# Altium schematic sheet Intan_RHS2116.SchDoc
size A4; DocumentNumber: 2; SheetNumber: 2; SheetTotal: 2
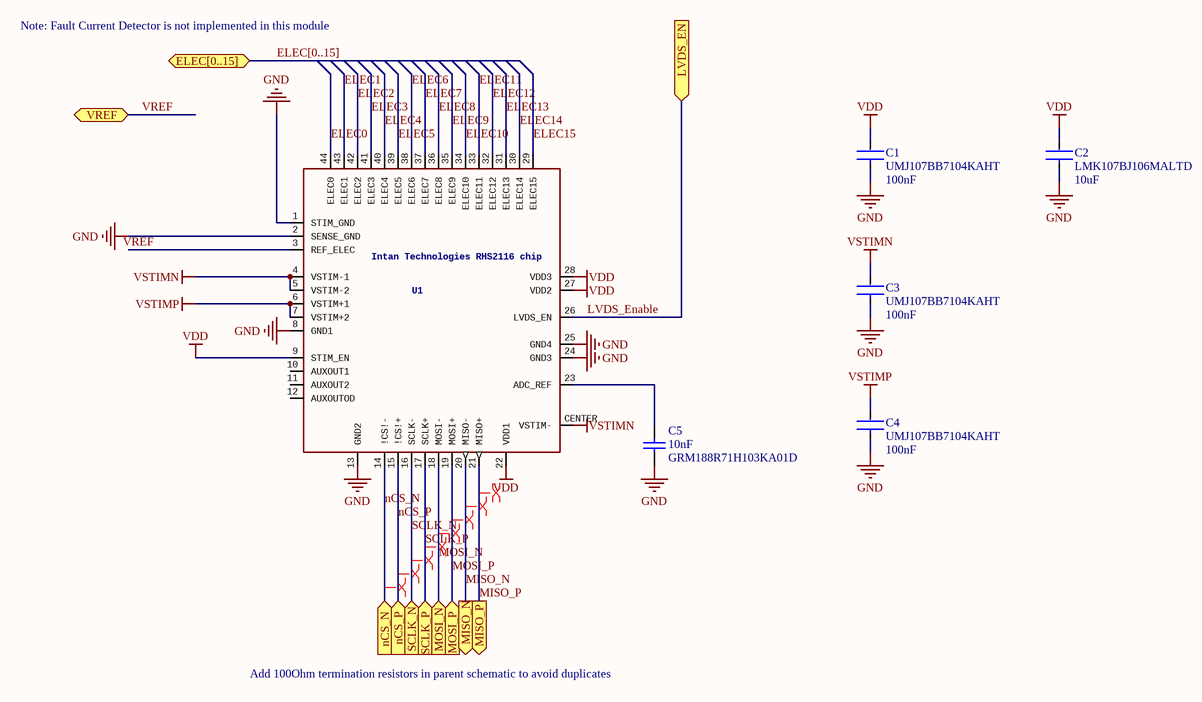
[diagram p0: Intan_RHS2116.SchDoc]

## Parts
C1  UMJ107BB7104KAHT  Capacitance: 100nF  [FP-0603-L_1_6_0_2-W_0_8_0-IPC_B]
C2  LMK107BJ106MALTD  Capacitance: 10uF  [FP-LMK107BJ106MALTD-IPC_B]
C3  UMJ107BB7104KAHT  Capacitance: 100nF  [FP-0603-L_1_6_0_2-W_0_8_0-IPC_B]
C4  UMJ107BB7104KAHT  Capacitance: 100nF  [FP-0603-L_1_6_0_2-W_0_8_0-IPC_B]
C5  GRM188R71H103KA01D  Capacitance: 10nF  [CAPC1608X90X35ML10T15]
U1  Intan Technologies RHS2116 chip  [QFN44_7_X_7]

## Ports
ELEC[0..15] (bidir), LVDS_EN (in), MISO_N (out), MISO_P (out), MOSI_N (in), MOSI_P (in), nCS_N (in), nCS_P (in), SCLK_N (in), SCLK_P (in), VREF (bidir)

## Nets
GND: C1.1 C2.1 C3.1 C4.1 C5.1 U1.1(STIM_GND) U1.2(SENSE_GND) U1.8(GND1) U1.13(GND2) U1.24(GND3) U1.25(GND4)
VDD: C1.2 C2.2 U1.9(STIM_EN) U1.22(VDD1) U1.27(VDD2) U1.28(VDD3)
VSTIMN: C3.2 U1.4(VSTIM-1) U1.5(VSTIM-2) U1.CENTER(VSTIM-)
VSTIMP: C4.2 U1.6(VSTIM+1) U1.7(VSTIM+2)
ELEC0: U1.44(ELEC0)
ELEC1: U1.43(ELEC1)
ELEC2: U1.42(ELEC2)
ELEC3: U1.41(ELEC3)
ELEC4: U1.40(ELEC4)
ELEC5: U1.39(ELEC5)
ELEC6: U1.38(ELEC6)
ELEC7: U1.37(ELEC7)
ELEC8: U1.36(ELEC8)
ELEC9: U1.35(ELEC9)
ELEC10: U1.34(ELEC10)
ELEC11: U1.33(ELEC11)
ELEC12: U1.32(ELEC12)
ELEC13: U1.31(ELEC13)
ELEC14: U1.30(ELEC14)
ELEC15: U1.29(ELEC15)
LVDS_Enable: U1.26(LVDS_EN) ; port LVDS_EN
MISO_N: U1.20(MISO-) ; port MISO_N
MISO_P: U1.21(MISO+) ; port MISO_P
MOSI_N: U1.18(MOSI-) ; port MOSI_N
MOSI_P: U1.19(MOSI+) ; port MOSI_P
nCS_N: U1.14(!CS!-) ; port nCS_N
nCS_P: U1.15(!CS!+) ; port nCS_P
SCLK_N: U1.16(SCLK-) ; port SCLK_N
SCLK_P: U1.17(SCLK+) ; port SCLK_P
VREF: U1.3(REF_ELEC) ; port VREF
NetC5_2: C5.2 U1.23(ADC_REF)

Not connected (* = marked no-connect by the designer): U1 10(AUXOUT1) 11(AUXOUT2) 12(AUXOUTOD)

## Buses and harness runs
bus ELEC[0..15] = port ELEC[0..15]

## Layout directives
differential pair: MISO_N, MISO_P, MOSI_N, MOSI_P, nCS_N, nCS_P, SCLK_N, SCLK_P

## Notes on the sheet
- Note: Fault Current Detector is not implemented in this module
- Add 100Ohm termination resistors in parent schematic to avoid duplicates

## Library data of the parts
C1 C3 C4 = CMP-14477-005276-2: Multilayer Ceramic Capacitor 0.1uF 50V X7R 10% SMD 0603 T/R; RoHS Compliant: Yes; Length: 0.063inch; Max Operating Temperature: 125°C; Case Code (Metric): 1608; Case/Package: 0603; Min Operating Temperature: -55°C; Tolerance: 10%; Mount: Surface Mount; Ratings: AEC-Q200; Features: Soft Termination; Thickness: 0.039inch; Width: 0.031inch; Packaging: Tape and Reel; Case Code (Imperial): 0603; Voltage Rating: 50V
C2 = CMP-2000-05443-2: CAP CER 10UF 10V X5R 0603; Tolerance: 20%; Series: M; Case Code (Metric): 1608; Height: 0.8mm; Resistor Type: Ceramic; Length: 1.6mm; REACH SVHC: No SVHC; Package Quantity: 4000; Lead Free: Lead Free; Voltage Rating (DC): 10V; Thickness: 0.035inch; Width: 0.031inch; Max Operating Temperature: 85°C; Number of Pins: 2; RoHS Compliant: Yes; Voltage Rating: 10V; Case/Package: 0603; Termination: SMD/SMT; Min Operating Temperature: -55°C; Dielectric: X5R; Construction: Flat; Packaging: Tape and Reel; Mount: Surface Mount; Case Code (Imperial): 0603
C5 = CMP-2100-03642-1: Chip Capacitor, 10 nF, +/- 10%, 50 V, -55 to 125 degC, 0603 (1608 Metric), RoHS, Tape and Reel; Manufacturer: Murata; Insulation Resistance: 10GR; Dielectric: X7R; Voltage Rating: 50V; Material: Ceramic; Package Quantity: 1; Lead Free: LeadFree; Case/Package: 0603; Termination: SMD/SMT; REACH SVHC: Unknown; Manufacturer URL: http://www.murata.com/; Datasheet URL: http://search.murata.co.jp/Ceramy/image/img/A01X/G101/ENG/GRM188R71H103KA01-01.pdf; Mount: SurfaceMount; Datasheet Version: 42401.0; Number of Pins: 2; Length: 1.6mm; Voltage: 50V; Depth: 0.8mm; Tolerance: 10%; Min Operating Temperature: -55degC; Voltage Rating (DC): 50V; Max Operating Temperature: 125degC; Package Description: 2-Pin Surface Mount Device, Body 1.6 x 0.8 mm; RoHSCompliant: True; Case Code (Imperial): 0603; Width: 0.031inch; Case Code (Metric): 1608; Height: 0.8mm; Package Reference: 0603; Packaging: TapeandReel; Thickness: 0.035inch; Dielectric Material: Ceramic
U1 = RHS2116_QFN: ComponentLink1Discription: Datasheet; ComponentLink2Discription: Bare Die; Pricing 1: 1-24=325;  25-99=278;  100-249=233;  250-499=188;  500-999=151  (USD); Supplier 1: Intan; Manufacturer: Intan Technologies; Manufacturer Part Number: RHS2116; Supplier Part Number 1: RHS2116; ComponentLink1URL: http://intantech.com/files/Intan_RHS2116_datasheet.pdf; ComponentLink2URL: http://intantech.com/files/RHS2116_die_diagram.pdf; Supplier Link 1: http://intantech.com/products_RHS2000.html